# Altium schematic sheet LPDDR2_16bits .SchDoc: LPDDR2_16bits
size A3; Date: Not used; ApprovedBy: Not used; CheckedBy: Not used; Author: Not used; CompanyName: STMicroelectronics; DrawnBy: Not used; Engineer: Not used; Organization: Not used; Address1: Not used; Address2: Not used; Address3: Not used; Address4: Not used; DocumentNumber: Not used; Revision: Not used; SheetNumber: 7; SheetTotal: 7; CurrentTime: Not used; CurrentDate: Not used; Time: Not used; DocumentFullPathAndName: Not used; DocumentName: Not used; ModifiedDate: Not used; ImagePath: Not used; Application_BuildNumber: Not used
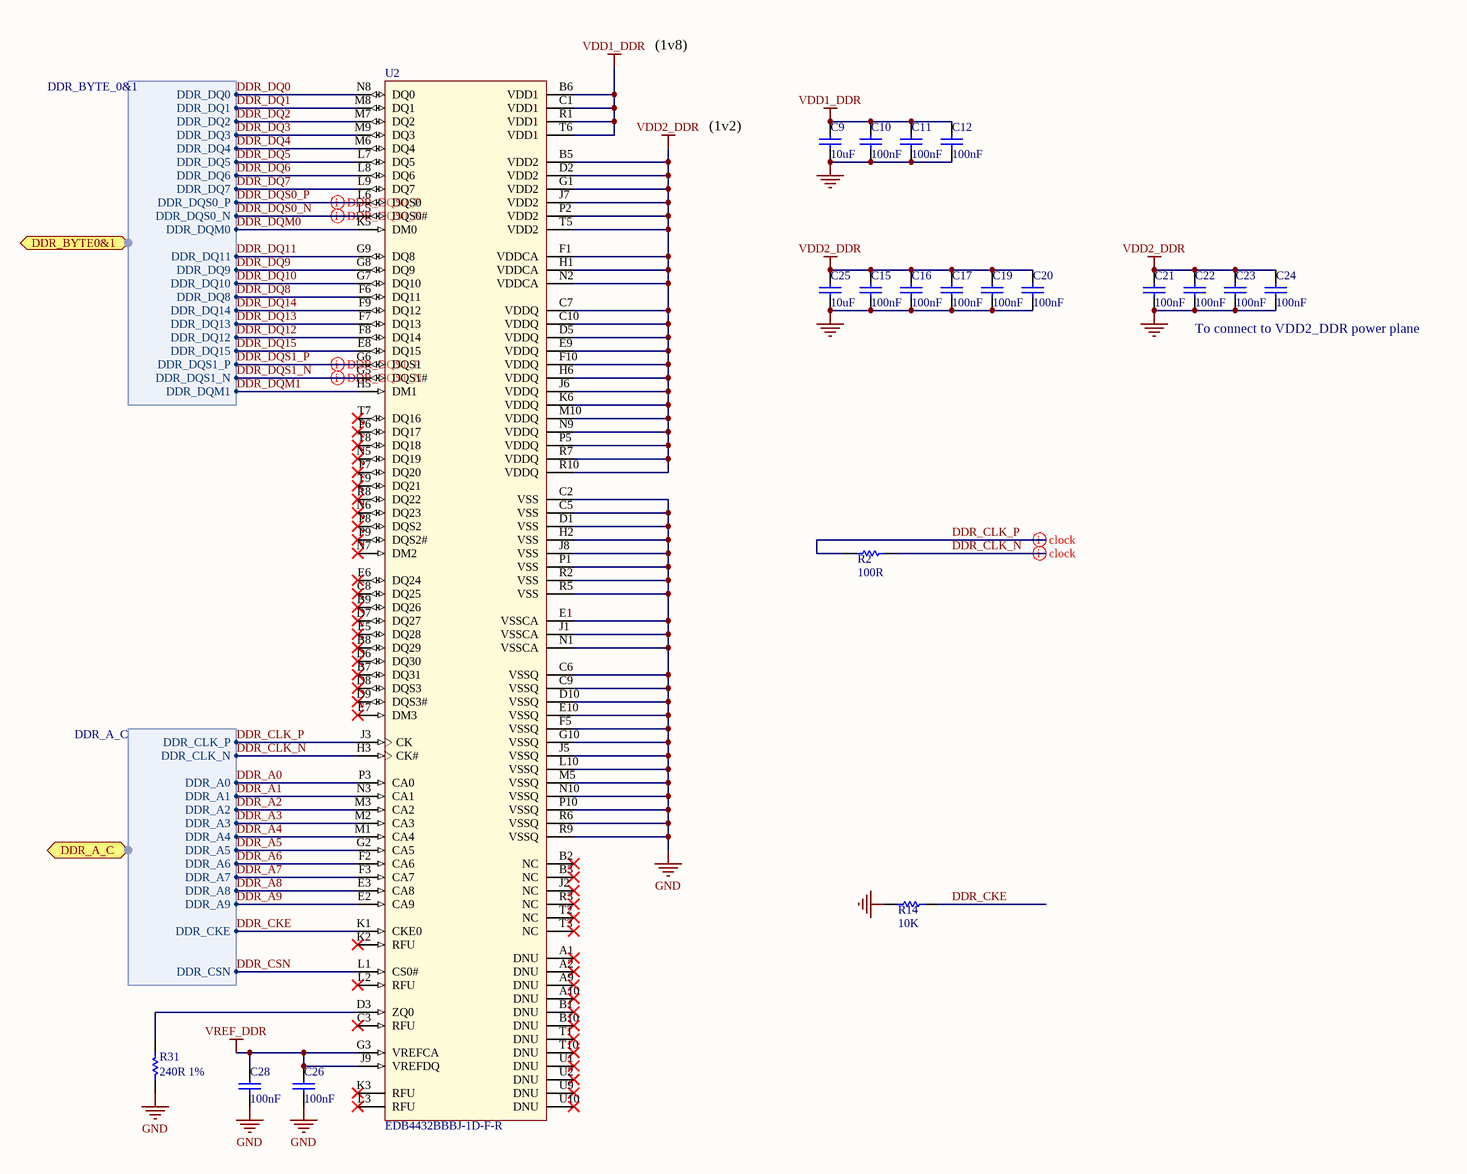
[diagram p0: LPDDR2_16bits .SchDoc]

## Parts
C9  value 10uF  [C0603]
C10  value 100nF  [C0402]
C11  value 100nF  [C0402]
C12  value 100nF  [C0402]
C15  value 100nF  [C0402]
C16  value 100nF  [C0402]
C17  value 100nF  [C0402]
C19  value 100nF  [C0402]
C20  value 100nF  [C0402]
C21  value 100nF  [C0402]
C22  value 100nF  [C0402]
C23  value 100nF  [C0402]
C24  value 100nF  [C0402]
C25  value 10uF  [C0603]
C26  value 100nF  [C0402]
C28  value 100nF  [C0402]
R2  value 100R  [R0402]
R14  value 10K  [R0402]
R31  value 240R 1%  [R0402]
U2  value EDB4432BBBJ-1D-F-R  [ICC_WFBGA134_SDP-SAC302_10X11P5_P065]

## Ports
DDR_A_C (harness DDR_A_C), DDR_BYTE0&1 (harness DDR_BYTE_0&1)

## Harnesses
DDR_BYTE_0&1: DDR_DQ0, DDR_DQ1, DDR_DQ2, DDR_DQ3, DDR_DQ4, DDR_DQ5, DDR_DQ6, DDR_DQ7, DDR_DQS0_P, DDR_DQS0_N, DDR_DQM0, DDR_DQ11, DDR_DQ9, DDR_DQ10, DDR_DQ8, DDR_DQ14, DDR_DQ13, DDR_DQ12, DDR_DQ15, DDR_DQS1_P, DDR_DQS1_N, DDR_DQM1
DDR_A_C: DDR_CLK_P, DDR_CLK_N, DDR_A0, DDR_A1, DDR_A2, DDR_A3, DDR_A4, DDR_A5, DDR_A6, DDR_A7, DDR_A8, DDR_A9, DDR_CSN, DDR_CKE

## Nets
GND: C9.1 C10.2 C11.2 C12.2 C15.2 C16.2 C17.2 C19.2 C20.2 C21.2 C22.2 C23.2 C24.2 C25.1 C26.2 C28.2 R14.1 R31.2 U2.C2(VSS) U2.C5(VSS) U2.C6(VSSQ) U2.C9(VSSQ) U2.D1(VSS) U2.D10(VSSQ) U2.E1(VSSCA) U2.E10(VSSQ) U2.F5(VSSQ) U2.G10(VSSQ) U2.H2(VSS) U2.J1(VSSCA) U2.J5(VSSQ) U2.J8(VSS) U2.L10(VSSQ) U2.M5(VSSQ) U2.N1(VSSCA) U2.N10(VSSQ) U2.P1(VSS) U2.P10(VSSQ) U2.R2(VSS) U2.R5(VSS) U2.R6(VSSQ) U2.R9(VSSQ)
VDD1_DDR: C9.2 C10.1 C11.1 C12.1 U2.B6(VDD1) U2.C1(VDD1) U2.R1(VDD1) U2.T6(VDD1)
VDD2_DDR: C15.1 C16.1 C17.1 C19.1 C20.1 C21.1 C22.1 C23.1 C24.1 C25.2 U2.B5(VDD2) U2.C7(VDDQ) U2.C10(VDDQ) U2.D2(VDD2) U2.D5(VDDQ) U2.E9(VDDQ) U2.F1(VDDCA) U2.F10(VDDQ) U2.G1(VDD2) U2.H1(VDDCA) U2.H6(VDDQ) U2.J6(VDDQ) U2.J7(VDD2) U2.K6(VDDQ) U2.M10(VDDQ) U2.N2(VDDCA) U2.N9(VDDQ) U2.P2(VDD2) U2.P5(VDDQ) U2.R7(VDDQ) U2.R10(VDDQ) U2.T5(VDD2)
VREF_DDR: C26.1 C28.1 U2.G3(VREFCA) U2.J9(VREFDQ)
DDR_A0: U2.P3(CA0) ; port DDR_A_C.DDR_A0
DDR_A1: U2.N3(CA1) ; port DDR_A_C.DDR_A1
DDR_A2: U2.M3(CA2) ; port DDR_A_C.DDR_A2
DDR_A3: U2.M2(CA3) ; port DDR_A_C.DDR_A3
DDR_A4: U2.M1(CA4) ; port DDR_A_C.DDR_A4
DDR_A5: U2.G2(CA5) ; port DDR_A_C.DDR_A5
DDR_A6: U2.F2(CA6) ; port DDR_A_C.DDR_A6
DDR_A7: U2.F3(CA7) ; port DDR_A_C.DDR_A7
DDR_A8: U2.E3(CA8) ; port DDR_A_C.DDR_A8
DDR_A9: U2.E2(CA9) ; port DDR_A_C.DDR_A9
DDR_CKE: R14.2 U2.K1(CKE0) ; port DDR_A_C.DDR_CKE
DDR_CLK_N: R2.2 U2.H3(CK#) ; port DDR_A_C.DDR_CLK_N
DDR_CLK_P: R2.1 U2.J3(CK) ; port DDR_A_C.DDR_CLK_P
DDR_CSN: U2.L1(CS0#) ; port DDR_A_C.DDR_CSN
DDR_DQ0: U2.N8(DQ0) ; port DDR_BYTE0&1.DDR_DQ0
DDR_DQ1: U2.M8(DQ1) ; port DDR_BYTE0&1.DDR_DQ1
DDR_DQ2: U2.M7(DQ2) ; port DDR_BYTE0&1.DDR_DQ2
DDR_DQ3: U2.M9(DQ3) ; port DDR_BYTE0&1.DDR_DQ3
DDR_DQ4: U2.M6(DQ4) ; port DDR_BYTE0&1.DDR_DQ4
DDR_DQ5: U2.L7(DQ5) ; port DDR_BYTE0&1.DDR_DQ5
DDR_DQ6: U2.L8(DQ6) ; port DDR_BYTE0&1.DDR_DQ6
DDR_DQ7: U2.L9(DQ7) ; port DDR_BYTE0&1.DDR_DQ7
DDR_DQ8: U2.F6(DQ11) ; port DDR_BYTE0&1.DDR_DQ8
DDR_DQ9: U2.G8(DQ9) ; port DDR_BYTE0&1.DDR_DQ9
DDR_DQ10: U2.G7(DQ10) ; port DDR_BYTE0&1.DDR_DQ10
DDR_DQ11: U2.G9(DQ8) ; port DDR_BYTE0&1.DDR_DQ11
DDR_DQ12: U2.F8(DQ14) ; port DDR_BYTE0&1.DDR_DQ12
DDR_DQ13: U2.F7(DQ13) ; port DDR_BYTE0&1.DDR_DQ13
DDR_DQ14: U2.F9(DQ12) ; port DDR_BYTE0&1.DDR_DQ14
DDR_DQ15: U2.E8(DQ15) ; port DDR_BYTE0&1.DDR_DQ15
DDR_DQM0: U2.K5(DM0) ; port DDR_BYTE0&1.DDR_DQM0
DDR_DQM1: U2.H5(DM1) ; port DDR_BYTE0&1.DDR_DQM1
DDR_DQS0_N: U2.L5(DQS0#) ; port DDR_BYTE0&1.DDR_DQS0_N
DDR_DQS0_P: U2.L6(DQS0) ; port DDR_BYTE0&1.DDR_DQS0_P
DDR_DQS1_N: U2.G5(DQS1#) ; port DDR_BYTE0&1.DDR_DQS1_N
DDR_DQS1_P: U2.G6(DQS1) ; port DDR_BYTE0&1.DDR_DQS1_P
NetR31_1: R31.1 U2.D3(ZQ0)

Not connected (* = marked no-connect by the designer): U2 A1(DNU)* A2(DNU)* A9(DNU)* A10(DNU)* B1(DNU)* B2(NC)* B3(NC)* B7(DQ31)* B8(DQ29)* B9(DQ26)* B10(DNU)* C3(RFU)* C8(DQ25)* D6(DQ30)* D7(DQ27)* D8(DQS3)* D9(DQS3#)* E5(DQ28)* E6(DQ24)* E7(DM3)* J2(NC)* K2(RFU)* K3(RFU)* L2(RFU)* L3(RFU)* N5(DQ19)* N6(DQ23)* N7(DM2)* P6(DQ17)* P7(DQ20)* P8(DQS2)* P9(DQS2#)* R3(NC)* R8(DQ22)* T1(DNU)* T2(NC)* T3(NC)* T7(DQ16)* T8(DQ18)* T9(DQ21)* T10(DNU)* U1(DNU)* U2(DNU)* U9(DNU)* U10(DNU)*

## Layout directives
differential pair: DDR_CLK_N, DDR_CLK_P, DDR_DQS0_N, DDR_DQS0_P, DDR_DQS1_N, DDR_DQS1_P

## Notes on the sheet
- (1v8)
- (1v2)
- To connect to VDD2_DDR power plane
- Title:
- Project:
- Size:
- Revision:
- Variant:
- A3
- -
- Date:
- Reference:
- Sheet:
- of

## Library data of the parts
C9 C25 = MCD-01124: Capacitor, MLCC, 10uF, 10V, X5R, 10%, 0603, T=0.8mm; Manufacturer_Part_Number: GRM188R61A106KAAL; Manufacturer: MURATA; Provided_By: SUBCO; ECCN_US: EAR99; ECCN_EU: NEC; Internal_Part_Number: MCD-01124; Status: Released; Part_Type: Capacitor; Package: C0603; ComponentLink1Description: Datasheet; ComponentLink1URL: http://tunmcdsvn.tun.st.com/Component_Datasheet_Library/Trunk/Capacitors/Murata_Capacitor_GR_series
C10-C12 C15-C17 C19-C24 C26 C28 = MCD-00006: Capacitor, MLCC, 100nF, 16V, X7R, 10%, 0402, T=0.5mm; Manufacturer_Part_Number: CC0402KRX7R7BB104; Manufacturer: YAGEO; Alternate_Manufacturer_Part_Number: GCM155R71C104KA55D; Alternate_Manufacturer: MURATA; Provided_By: SUBCO; ECCN_US: EAR99; ECCN_EU: NEC; Internal_Part_Number: MCD-00006; Status: Released; Part_Type: Capacitor; Package: C0402; ComponentLink1Description: Datasheet; ComponentLink1URL: http://tunmcdsvn.tun.st.com/Component_Datasheet_Library/Trunk/Capacitors/Yageo_Multilayer_Capacitor_X7R_series_100pF_to_22uF
R2 = MCD-00067: Resistor,100R,0402,1%,1/16W; Manufacturer_Part_Number: RC0402FR-07100RL; Manufacturer: YAGEO; Provided_By: SUBCO; ECCN_US: EAR99; ECCN_EU: NEC; Internal_Part_Number: MCD-00067; Status: Released; Part_Type: Resistor; Package: R0402; ComponentLink1Description: Datasheet; ComponentLink1URL: http://tunmcdsvn.tun.st.com/Component_Datasheet_Library/Trunk/Resistors/Yageo_Resistor_RC0402-series
R14 = MCD-00053: Resistor,10K,0402,1%,1/16W; Manufacturer_Part_Number: RC0402FR-0710KL; Manufacturer: YAGEO; BMS_Part_Number: 9131590; Provided_By: SUBCO; ECCN_US: EAR99; ECCN_EU: NEC; Internal_Part_Number: MCD-00053; Status: Released; Part_Type: Resistor; Package: R0402; ComponentLink1Description: Datasheet; ComponentLink1URL: http://tunmcdsvn.tun.st.com/Component_Datasheet_Library/Trunk/Resistors/Yageo_Resistor_RC0402-series
R31 = MCD-00120: Resistor,240R,0402,1%,1/16W; Manufacturer_Part_Number: RC0402FR-07240RL; Manufacturer: YAGEO; ECCN_US: EAR99; ECCN_EU: NEC; Provided_By: SUBCO; Internal_Part_Number: MCD-00120; ComponentLink1Description: Datasheet; Status: Released; Part_Type: Resistor; ComponentLink1URL: http://tunmcdsvn.tun.st.com/Component_Datasheet_Library/Trunk/Resistors/Yageo_Resistor_RC0402-series; Package: R0402
U2 = MCD-01223: Memory,LPDDR2,4Gb,128Mbx32,533MHz,1066Mb/s,1V8/1V2,FBGA134; Part_Type: IC; Manufacturer: MICRON; Provided_By: SUBCO; Internal_Part_Number: MCD-01223; Status: Released; Manufacturer_Part_Number: EDB4432BBBJ-1D-F-R; Package: WFBGA134 10x11.5; ComponentLink1Description: Datasheet; ComponentLink1URL: http://tunmcdsvn.tun.st.com/Component_Datasheet_Library/Trunk/IC/Micron_LPDDR2_134b_10x11.5_EDB4432BBBJ-1D-F-R; ECCN_US: n/a; ECCN_EU: n/a